# EAGLE design EXIST_Transformer_PCB (EAGLE 9.1.3)
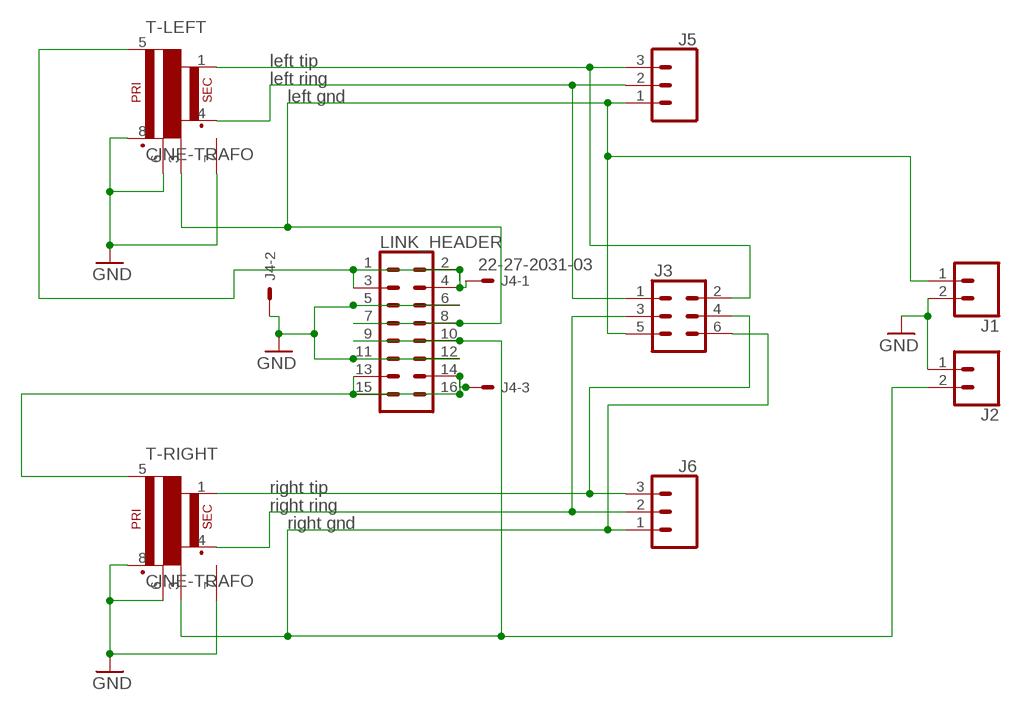
[diagram p0: schematic, sheet 1]

## Parts
J1  CONN_02  [1X02]
J2  CONN_02  [1X02]
J3  CONN_03X22X3_SILK_MALE_PTH  [2X3]
J4  22-27-2031-03  [6410-03]
J5  CONN_03LONGPADS  [1X03_LONGPADS]
J6  CONN_03LONGPADS  [1X03_LONGPADS]
LINK_HEADER  CONN_08X2  [2X8]
T-LEFT  CINE-TRAFO  [CIRC-TRAFO]
T-RIGHT  CINE-TRAFO  [CIRC-TRAFO]

## Nets
GND: J1.2 J2.1 J4.2 LINK_HEADER.5 LINK_HEADER.6 LINK_HEADER.11 LINK_HEADER.12 T-LEFT.6(C1) T-LEFT.7(CASE) T-LEFT.8(P2) T-RIGHT.6(C1) T-RIGHT.7(CASE) T-RIGHT.8(P2)
LEFT-GND: J1.1 J3.5 J5.1 LINK_HEADER.7 LINK_HEADER.8 T-LEFT.3(C2)
LEFT-RING: J3.1 J5.2 T-LEFT.4(S2)
N$2: J3.2 J5.3 T-LEFT.1(S1)
N$3: J3.4 J6.3 T-RIGHT.1(S1)
N$4: J3.3 J6.2 T-RIGHT.4(S2)
N$6: J4.3 LINK_HEADER.13 LINK_HEADER.14 LINK_HEADER.15 LINK_HEADER.16 T-RIGHT.5(P1)
N$8: J4.1 LINK_HEADER.1 LINK_HEADER.2 LINK_HEADER.3 LINK_HEADER.4 T-LEFT.5(P1)
RIGHT-GND: J2.2 J3.6 J6.1 LINK_HEADER.9 LINK_HEADER.10 T-RIGHT.3(C2)

## Notes on the sheet
- left tip
- left ring
- left gnd
- right tip
- right ring
- right gnd

## Library data of the parts
J1 J2 = SparkFun-Connectors:CONN_02: Multi connection point. Often used as Generic Header-pin footprint for 0.1 inch spaced/style header connections On any of the 0.1 inch spaced packages, you can populate with these: Break Away Headers - Straight <https://www.sparkfun.com/products/116> (PRT-00116) Break Away Male Headers - Right Angle <https://www.sparkfun.com/products/553> (PRT-00553) Female Headers <https://www.sparkfun.com/products/115> (PRT-00115) Break Away Headers - Machine Pin <https://www.sparkfun.com/products/117> (PRT-00117) Break Away Female Headers - Swiss Machine Pin <https://www.sparkfun.com/products/743> (PRT-00743) For SCREWTERMINALS and SPRING TERMINALS visit here: Screw Terimnals on SparkFun.com <https://www.sparkfun.com/search/results?term=Screw+Terminals> (5mm/3.5mm/2.54mm spacing) This device is also useful as a general connection point to wire up your design to another part of your project. Our various solder wires solder well into these plated through hole pads. Hook-Up Wire - Assortment (Stranded, 22 AWG) <https://www.sparkfun.com/products/11375> (PRT-11375) Hook-Up Wire - Assortment (Solid Core, 22 AWG) <https://www.sparkfun.com/products/11367> (PRT-11367) View the entire wire category on our website here <https://www.sparkfun.com/categories/141> Special notes: Molex polarized connector foot print use with: PRT-08233 with associated crimp pins and housings. 2.54_SCREWTERM for use with PRT-10571. 3.5mm Screw Terminal footprints for PRT-08084 5mm Screw Terminal footprints for use with PRT-08432
J3 = SparkFun-Connectors:CONN_03X2: Multi connection point. Often used as Generic Header-pin footprint for 0.1 inch spaced/style header connections You can populate with any combo of single row headers, but if you'd like an exact match, check these: Header - 2x3 (Male, 0.1") <https://www.sparkfun.com/products/12807> (PRT-12807) Header - 2x3 (Female, 0.1") <https://www.sparkfun.com/products/13010> (PRT-13010) 2x3 Pin Shrouded Header <https://www.sparkfun.com/products/10877> (PRT-10877) On any of the 0.1 inch spaced packages, you can populate with these: Break Away Headers - Straight <https://www.sparkfun.com/products/116> (PRT-00116) Break Away Male Headers - Right Angle <https://www.sparkfun.com/products/553> (PRT-00553) Female Headers <https://www.sparkfun.com/products/115> (PRT-00115) Break Away Headers - Machine Pin <https://www.sparkfun.com/products/117> (PRT-00117) Break Away Female Headers - Swiss Machine Pin <https://www.sparkfun.com/products/743> (PRT-00743) Special note: the shrouded connector mates well with our 3x2 ribbon cables: Ribbon Crimp Connector - 6-pin (2x3, Female) <https://www.sparkfun.com/products/10651> (PRT-10651) Ribbon Cable - 6 wire (15ft) <https://www.sparkfun.com/products/10646> (PRT-10646); PROD_ID: CONN-09701
J4 = con-molex:22-?-03: CONNECTOR wire to board 2.54 mm (.1 inch) pitch header; MF: MOLEX; OC_FARNELL: unknown; OC_NEWARK: unknown
J5 J6 = SparkFun-Connectors:CONN_03: Multi connection point. Often used as Generic Header-pin footprint for 0.1 inch spaced/style header connections On any of the 0.1 inch spaced packages, you can populate with these: Break Away Headers - Straight <https://www.sparkfun.com/products/116> (PRT-00116) Break Away Male Headers - Right Angle <https://www.sparkfun.com/products/553> (PRT-00553) Female Headers <https://www.sparkfun.com/products/115> (PRT-00115) Break Away Headers - Machine Pin <https://www.sparkfun.com/products/117> (PRT-00117) Break Away Female Headers - Swiss Machine Pin <https://www.sparkfun.com/products/743> (PRT-00743) Stackable Header - 3 Pin (Female, 0.1") <https://www.sparkfun.com/products/13875> (PRT-13875) For SCREWTERMINALS and SPRING TERMINALS visit here: Screw Terimnals on SparkFun.com <https://www.sparkfun.com/search/results?term=Screw+Terminals> (5mm/3.5mm/2.54mm spacing) This device is also useful as a general connection point to wire up your design to another part of your project. Our various solder wires solder well into these plated through hole pads. Hook-Up Wire - Assortment (Stranded, 22 AWG) <https://www.sparkfun.com/products/11375> (PRT-11375) Hook-Up Wire - Assortment (Solid Core, 22 AWG) <https://www.sparkfun.com/products/11367> (PRT-11367) View the entire wire category on our website here <https://www.sparkfun.com/categories/141> Special notes: Molex polarized connector foot print use with SKU : PRT-08232 with associated crimp pins and housings.
LINK_HEADER = SparkFun-Connectors:CONN_08X2: Multi connection point. Often used as Generic Header-pin footprint for 0.1 inch spaced/style header connections You can populate with any combo of single row headers, but if you'd like an exact match, check this: Header - 2x8 (Male, 0.1") <https://www.sparkfun.com/products/13156> (PRT-13156) On any of the 0.1 inch spaced packages, you can populate with these: Break Away Headers - Straight <https://www.sparkfun.com/products/116> (PRT-00116) Break Away Male Headers - Right Angle <https://www.sparkfun.com/products/553> (PRT-00553) Female Headers <https://www.sparkfun.com/products/115> (PRT-00115) Break Away Headers - Machine Pin <https://www.sparkfun.com/products/117> (PRT-00117) Break Away Female Headers - Swiss Machine Pin <https://www.sparkfun.com/products/743> (PRT-00743)
T-LEFT T-RIGHT = monome_modular:CINE-TRAFO

## Board
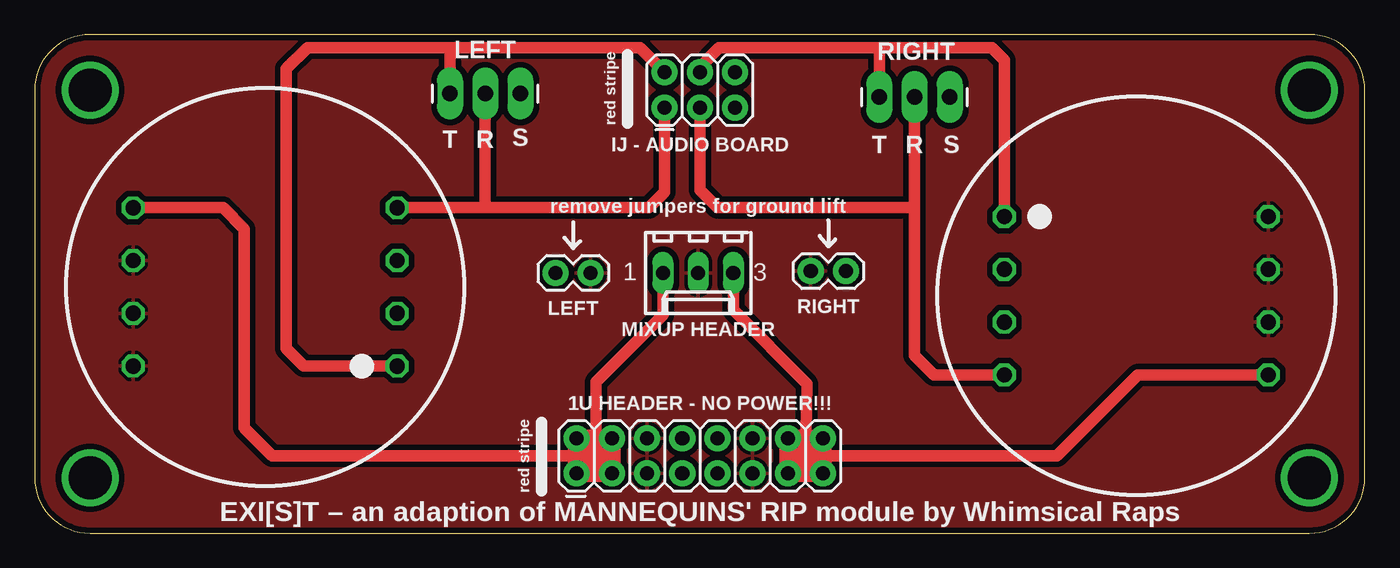
[diagram p1: board, top side]
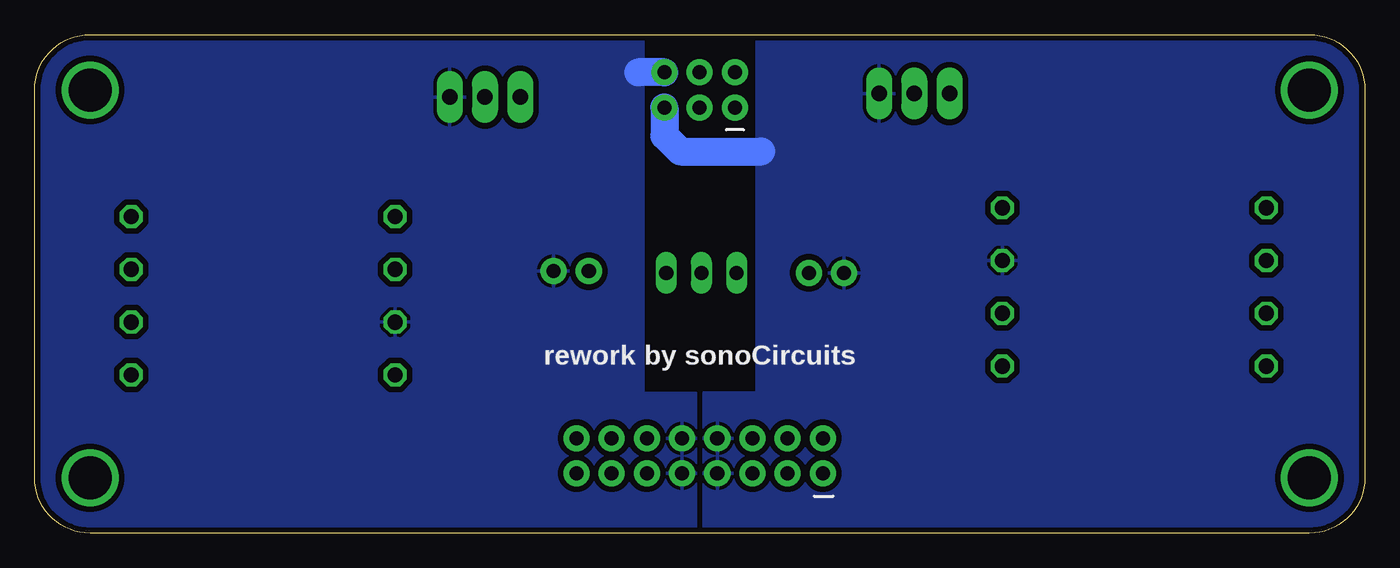
[diagram p2: board, bottom side, seen from below]

Size 96 x 36 mm. Coordinates in mm from the lower left corner, seen from the top.
Outline: 0,32 0,4 arc90 4,0 92,0 arc90 96,4 96,32 arc90 92,36 4,36 arc90 0,32
Copper layers (1*16): Top 0.035mm / dielectric 1.5mm / Bottom 0.035mm
Design rules "default *": minimum track width 6mil, minimum drill 0.35mm, track to track 6mil, track to pad 6mil, pad to pad 6mil, via to via 6mil, smd to smd 6mil, copper to edge 10mil, drill to drill 6mil, minimum pad ring 10mil, minimum via ring 8mil, stop-mask expansion 4mil, vias tented up to drill 0mil, thermal gap 10mil

### Footprints (pad centres in the part's own frame; a part is rotated, then mirrored left to right if it is on the bottom)
1X02 = drill 1.016 pad 1.88: 1 0,0; 2 2.54,0
2X3 = drill 1.016 pad 1.88: 1 0,0; 2 0,2.54; 3 2.54,0; 4 2.54,2.54; 5 5.08,0; 6 5.08,2.54
6410-03 = drill 1.016 long: 1 2.54,0; 2 0,0; 3 -2.54,0
1X03_LONGPADS = drill 1.118 pad 1.88 long: 1 0,0; 2 2.54,0; 3 5.08,0
2X8 = drill 1.016 pad 1.88: 1 0,0; 2 0,2.54; 3 2.54,0; 4 2.54,2.54; 5 5.08,0; 6 5.08,2.54; 7 7.62,0; 8 7.62,2.54; 9 10.16,0; 10 10.16,2.54; 11 12.7,0; 12 12.7,2.54; 13 15.24,0; 14 15.24,2.54; 15 17.78,0; 16 17.78,2.54
CIRC-TRAFO = drill 1.1 octagon: 1 -9.525,5.715; 2 -9.525,1.905; 3 -9.525,-1.905; 4 -9.525,-5.715; 5 9.525,-5.715; 6 9.525,-1.905; 7 9.525,1.905; 8 9.525,5.715

### Placement (x,y rotation side)
J1  37.59,18.8 0 top
J2  56.01,18.92 0 top
J3  45.47,30.73 0 top
J4  47.88,18.8 180 top
J5  35.05,31.75 180 top
J6  66.04,31.5 180 top
LINK_HEADER  39.12,4.32 0 top
T-LEFT  16.64,17.78 180 top
T-RIGHT  79.5,17.14 0 top

### Tracks (layer width: path | path; a pad name or v marks a point on that pad's centre or on a via)
GND
  pour Top (isolate 0.406): 91.81,0.05 4.13,0.05 arc-90 0.13,4.05 0.13,31.94 arc-90 4.13,35.94 91.76,35.94 arc-90 95.76,31.94 95.76,4 arc-90
LEFT-GND
  Bottom 2.032: J3.5 50.55,28.7 49.4,27.56 43.56,27.56
  pour Bottom (isolate 0.406): 47.75,0.17 4.13,0.17 arc-90 0.13,4.17 0.13,31.94 arc-90 4.13,35.94 43.94,35.94 43.94,10.16 47.75,10.16
LEFT-RING
  Top 0.813: J5.2 32.51,23.5 | 32.51,23.5 T-LEFT.4 | J3.1 45.47,24.64 44.32,23.5 32.51,23.5
N$1  (via drill 3.1)
  other vias: 4,4
N$2
  Top 0.813: J3.2 43.69,35.05 29.97,35.05 | 29.97,35.05 19.68,35.05 18.16,33.53 18.16,13.34 19.43,12.06 T-LEFT.1 | J5.3 29.97,35.05
N$3
  Top 0.813: J3.4 48.01,33.66 49.4,35.05 60.96,35.05 | J6.3 60.96,34.54 60.96,35.05 | T-RIGHT.1 69.98,34.16 69.09,35.05 60.96,35.05
N$4
  Top 0.813: J3.3 48.01,24.77 49.28,23.5 63.5,23.5 | J6.2 63.5,25.4 63.5,23.5 | T-RIGHT.4 64.9,11.43 63.5,12.83 63.5,23.37 63.5,23.5
N$5  (via drill 3.1)
  other vias: 4,32
N$6
  Top 0.813: J4.3 50.42,16.13 55.75,10.79 55.63,5.59 73.79,5.59 79.63,11.43 T-RIGHT.5
  Top 1.27: LINK_HEADER.14 LINK_HEADER.16 | LINK_HEADER.16 LINK_HEADER.15 | LINK_HEADER.15 LINK_HEADER.13 | LINK_HEADER.13 LINK_HEADER.14 | LINK_HEADER.14 55.63,5.59 | 55.63,5.59 LINK_HEADER.15 | LINK_HEADER.13 55.63,5.59 | 55.63,5.59 LINK_HEADER.16
N$7  (via drill 3.1)
  other vias: 92,32
N$8
  Top 0.813: T-LEFT.5 13.59,23.5 15.11,21.97 15.11,7.62 17.14,5.59 40.39,5.59 40.51,5.71 40.51,10.92 45.34,15.75 J4.1
  Top 1.27: LINK_HEADER.2 LINK_HEADER.4 | LINK_HEADER.4 LINK_HEADER.3 | LINK_HEADER.3 LINK_HEADER.1 | LINK_HEADER.1 LINK_HEADER.2 | LINK_HEADER.2 40.39,5.59 | 40.39,5.59 LINK_HEADER.3 | LINK_HEADER.1 40.39,5.59 | 40.39,5.59 LINK_HEADER.4
N$9  (via drill 3.1)
  other vias: 92,4
RIGHT-GND
  Bottom 2.032: J3.6 52.45,33.27
  pour Bottom (isolate 0.406): 48.26,10.16 48.26,0.25 92.14,0.25 arc90 96.14,4.25 96.14,31.81 arc90 92.14,35.81 52.07,35.81 52.07,10.16 48.64,10.16

### Text on the board
tPlace: red stripe | red stripe
tNames: LEFT | RIGHT | S | T | R | IJ - AUDIO BOARD | T | R | S | remove jumpers for ground lift | LEFT | RIGHT | MIXUP HEADER | 1U HEADER - NO POWER!!! | EXI[S]T – an adaption of MANNEQUINS' RIP module by Whimsical Raps
bNames: rework by sonoCircuits